# Altium schematic sheet DBBC7205S.SchDoc
size A2; SheetNumber: 1; SheetTotal: 1
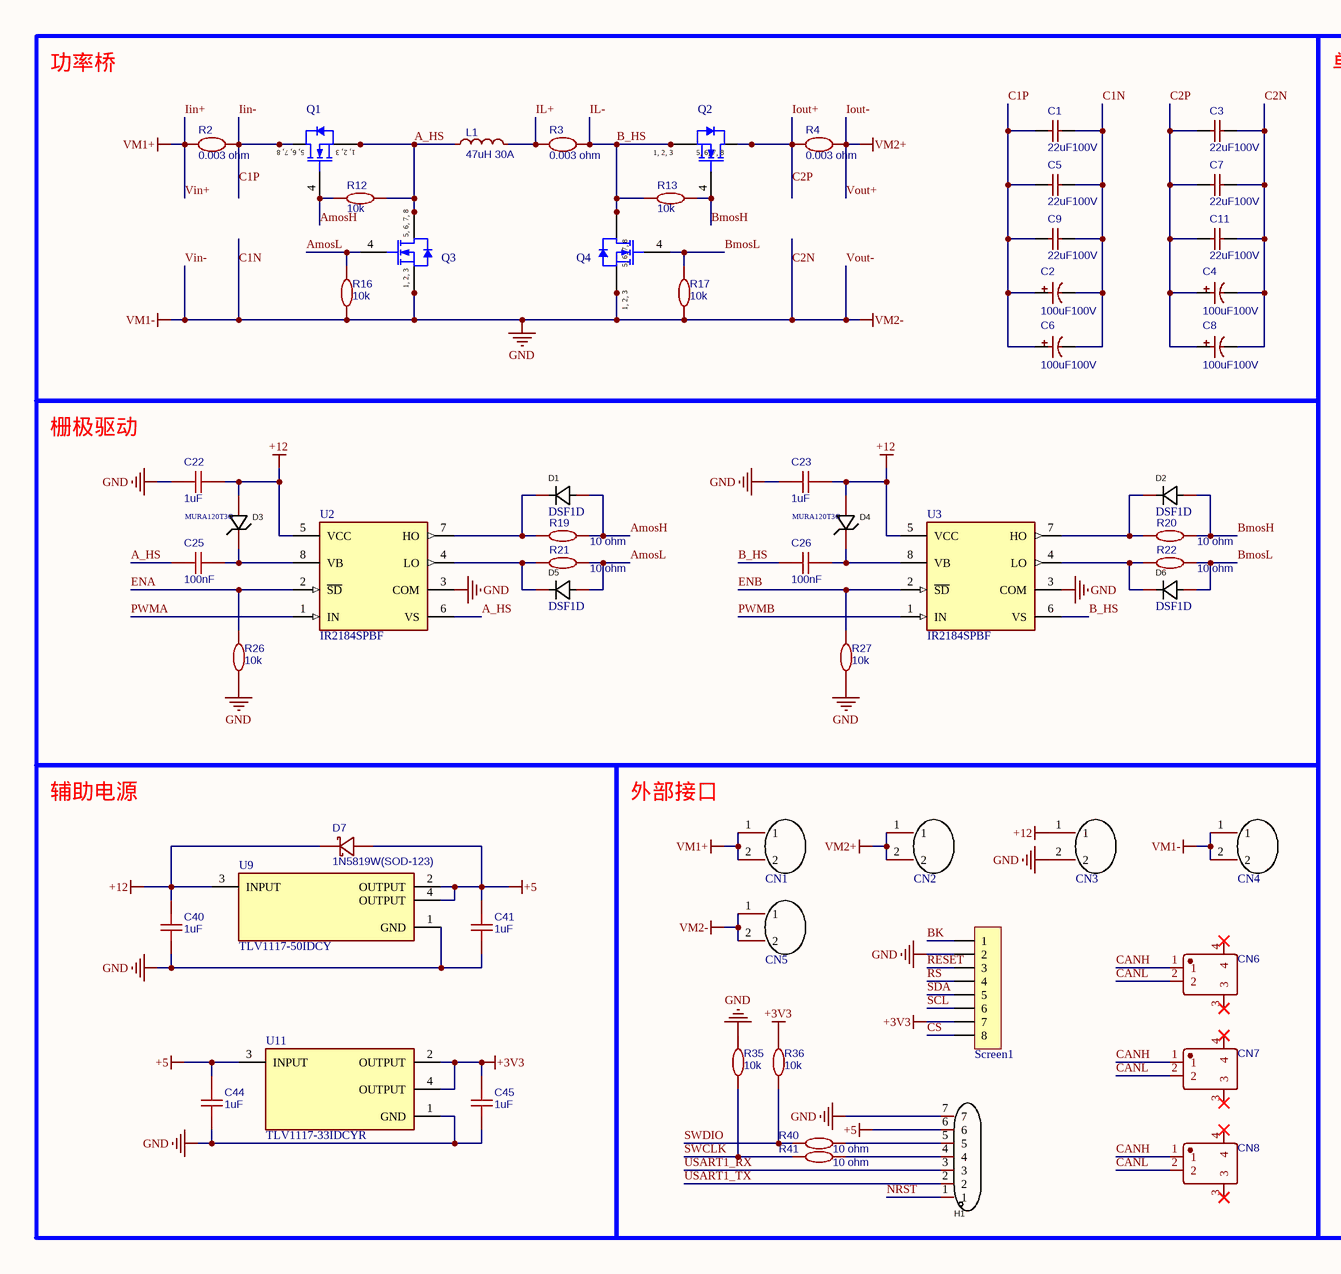
[diagram p0: DBBC7205S.SchDoc, left]
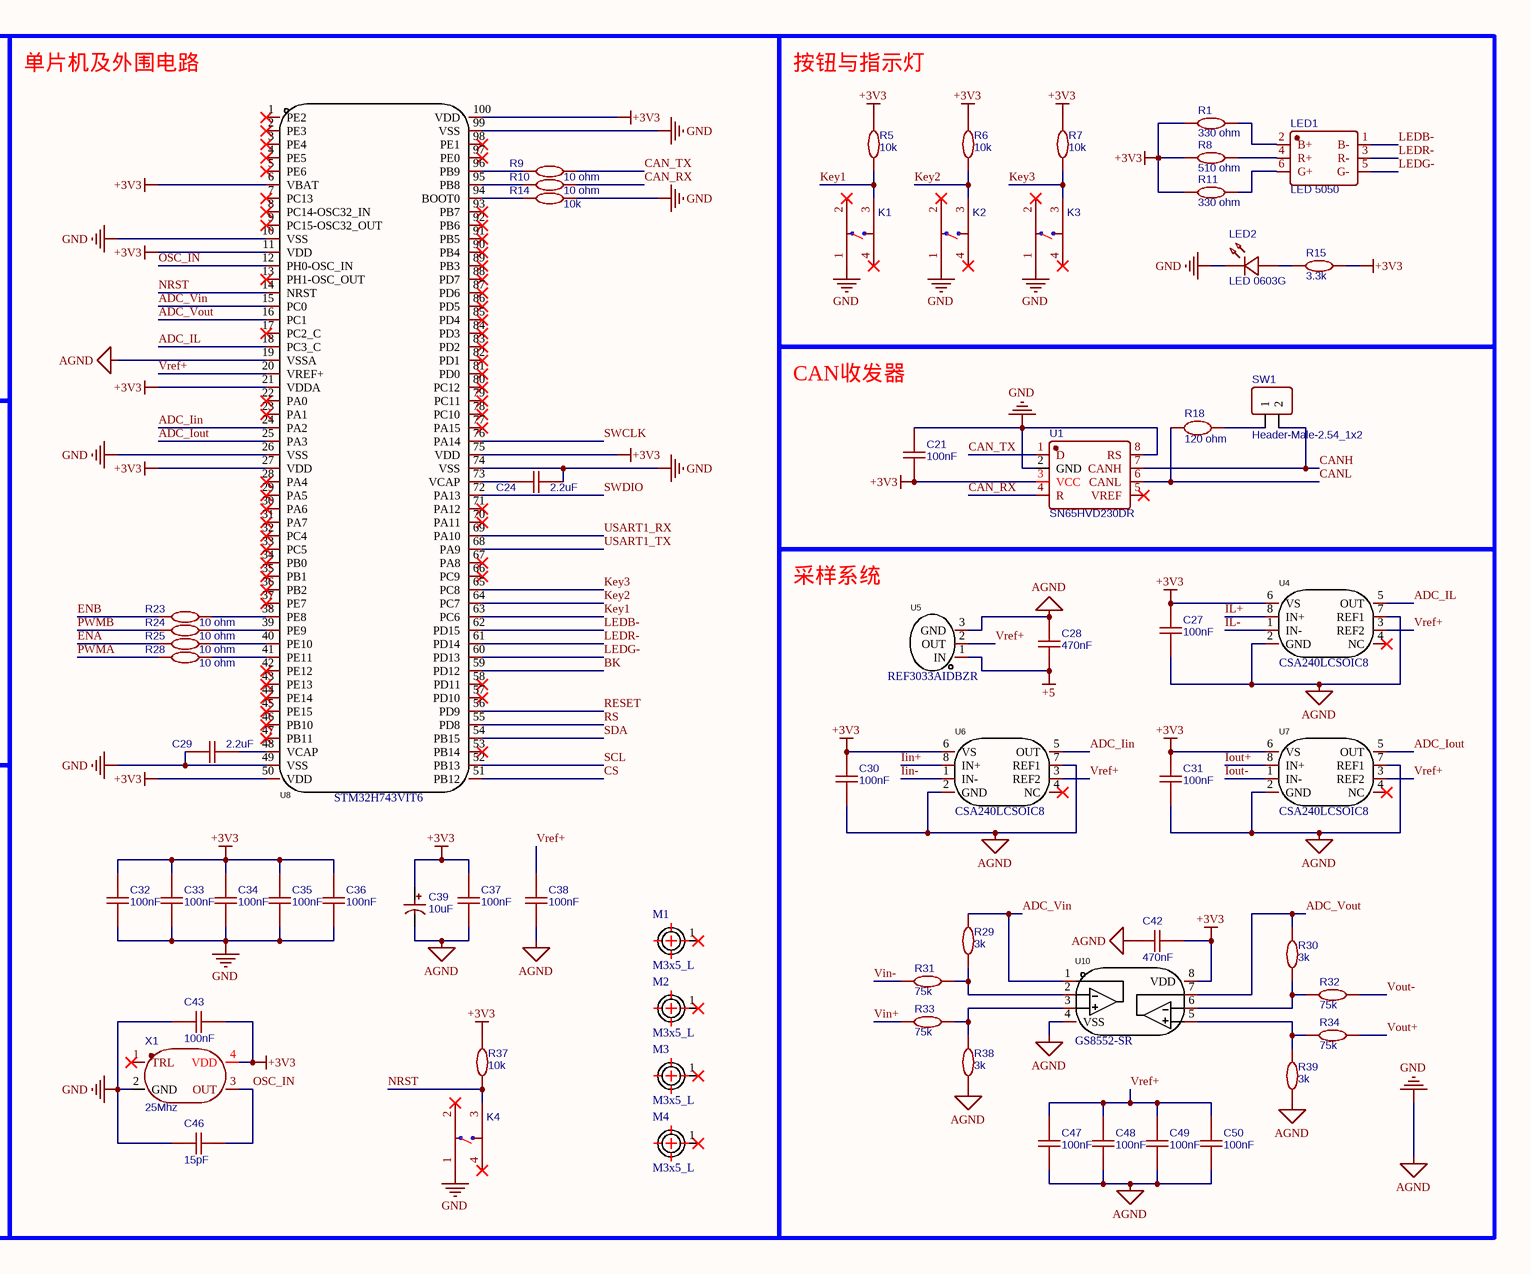
[diagram p1: DBBC7205S.SchDoc, right]

## Parts
C1  22uF100V  [C1206]
C2  100uF100V  [CAP 5.0*10*16]
C3  22uF100V  [C1206]
C4  100uF100V  [CAP 5.0*10*16]
C5  22uF100V  [C1206]
C6  100uF100V  [CAP 5.0*10*16]
C7  22uF100V  [C1206]
C8  100uF100V  [CAP 5.0*10*16]
C9  22uF100V  [C1206]
C11  22uF100V  [C1206]
C21  100nF  [C0603]
C22  1uF  [C0603]
C23  1uF  [C0603]
C24  2.2uF  [C0603]
C25  100nF  [C0603]
C26  100nF  [C0603]
C27  100nF  [C0603]
C28  470nF  [C0603]
C29  2.2uF  [C0603]
C30  100nF  [C0603]
C31  100nF  [C0603]
C32  100nF  [C0603]
C33  100nF  [C0603]
C34  100nF  [C0603]
C35  100nF  [C0603]
C36  100nF  [C0603]
C37  100nF  [C0603]
C38  100nF  [C0603]
C39  10uF  [CD A(3216)]
C40  1uF  [C0603]
C41  1uF  [C0603]
C42  470nF  [C0603]
C43  100nF  [C0603]
C44  1uF  [C0603]
C45  1uF  [C0603]
C46  15pF  [C0603]
C47  100nF  [C0603]
C48  100nF  [C0603]
C49  100nF  [C0603]
C50  100nF  [C0603]
CN1  1729128  [CONN-TH_2P-P5.08]  (value not drawn)
CN2  1729128  [CONN-TH_2P-P5.08]  (value not drawn)
CN3  1729128  [CONN-TH_2P-P5.08]  (value not drawn)
CN4  1729128  [CONN-TH_2P-P5.08]  (value not drawn)
CN5  1729128  [CONN-TH_2P-P5.08]  (value not drawn)
CN6  A1257WR-S-2P  [CONN-SMD_A1257WR-S-2P]  (value not drawn)
CN7  A1257WR-S-2P  [CONN-SMD_A1257WR-S-2P]  (value not drawn)
CN8  A1257WR-S-2P  [CONN-SMD_A1257WR-S-2P]  (value not drawn)
D1  DSF1D  [SOD-123_L2.8-W1.8-LS3.7-RD]
D2  DSF1D  [SOD-123_L2.8-W1.8-LS3.7-RD]
D3  MURA120T3G  [SMA]
D4  MURA120T3G  [SMA]
D5  DSF1D  [SOD-123_L2.8-W1.8-LS3.7-RD]
D6  DSF1D  [SOD-123_L2.8-W1.8-LS3.7-RD]
D7  1N5819W(SOD-123)  [SOD-123]
H1  7P卧贴排母  [HDR-SMD_7P-P2.54-H-F-L11.5]  (value not drawn)
K1  TSW SMD-6*6*5  [TSW SMD-6*6*5]  (value not drawn)
K2  TSW SMD-6*6*5  [TSW SMD-6*6*5]  (value not drawn)
K3  TSW SMD-6*6*5  [TSW SMD-6*6*5]  (value not drawn)
K4  TSW SMD-6*6*5  [TSW SMD-6*6*5]  (value not drawn)
L1  47uH 30A  [106-125卧式]
LED1  LED 5050  [LED 5050]
LED2  LED 0603G  [LED 0603G]
M1  M3x5_L  [M3x5_L]
M2  M3x5_L  [M3x5_L]
M3  M3x5_L  [M3x5_L]
M4  M3x5_L  [M3x5_L]
Q1  BSC070N10NS3 G  [INF-PG-TDSON-8-1_V]  (value not drawn)
Q2  BSC070N10NS3 G  [INF-PG-TDSON-8-1_V]  (value not drawn)
Q3  BSC070N10NS3 G  [INF-PG-TDSON-8-1_V]  (value not drawn)
Q4  BSC070N10NS3 G  [INF-PG-TDSON-8-1_V]  (value not drawn)
R1  330 ohm  [R0603]
R2  0.003 ohm  [R2512]
R3  0.003 ohm  [R2512]
R4  0.003 ohm  [R2512]
R5  10k  [R0603]
R6  10k  [R0603]
R7  10k  [R0603]
R8  510 ohm  [R0603]
R9  10 ohm  [R0603]
R10  10 ohm  [R0603]
R11  330 ohm  [R0603]
R12  10k  [R0603]
R13  10k  [R0603]
R14  10k  [R0603]
R15  3.3k  [R0603]
R16  10k  [R0603]
R17  10k  [R0603]
R18  120 ohm  [R0805]
R19  10 ohm  [R0603]
R20  10 ohm  [R0603]
R21  10 ohm  [R0603]
R22  10 ohm  [R0603]
R23  10 ohm  [R0603]
R24  10 ohm  [R0603]
R25  10 ohm  [R0603]
R26  10k  [R0603]
R27  10k  [R0603]
R28  10 ohm  [R0603]
R29  3k  [R0603]
R30  3k  [R0603]
R31  75k  [R0603]
R32  75k  [R0603]
R33  75k  [R0603]
R34  75k  [R0603]
R35  10k  [R0603]
R36  10k  [R0603]
R37  10k  [R0603]
R38  3k  [R0603]
R39  3k  [R0603]
R40  10 ohm  [R0603]
R41  10 ohm  [R0603]
Screen1  FPC0.5-8P  [FPC0.5 2H-S-W-8P]  (value not drawn)
SW1  Header-Male-2.54_1x2  [HDR2.54-LI-2P]
U1  SN65HVD230DR  [SOP-8]
U2  IR2184SPBF  [FP-PG-DSO-8-MFG]
U3  IR2184SPBF  [FP-PG-DSO-8-MFG]
U4  CSA240LCSOIC8  [SOIC-8_L4.9-W3.9-P1.27-LS6.0-BL]
U5  REF3033AIDBZR  [SOT-23-3_L3.0-W1.7-P0.95-LS2.9-BR]
U6  CSA240LCSOIC8  [SOIC-8_L4.9-W3.9-P1.27-LS6.0-BL]
U7  CSA240LCSOIC8  [SOIC-8_L4.9-W3.9-P1.27-LS6.0-BL]
U8  STM32H743VIT6  [LQFP-100_L14.0-W14.0-P0.50-LS16.0-BL]
U9  TLV1117-50IDCY  [FP-DCY0004A-MFG]
U10  GS8552-SR  [SOIC-8_L4.9-W3.9-P1.27-LS6.0-BL]
U11  TLV1117-33IDCYR  [FP-DCY0004A-MFG]
X1  25Mhz  [OSC 3225-4P]

## Blocks framed on the sheet
功率桥: C1-C9 C11 L1 Q1-Q4 R2-R4 R12 R13 R16 R17
单片机及外围电路: C24 C29 C32-C39 C43 C46 K4 M1-M4 R9 R10 R14 R23-R25 R28 R37 U8 X1
按钮与指示灯: K1-K3 LED1 LED2 R1 R5-R8 R11 R15
CAN收发器: C21 R18 SW1 U1
栅极驱动: C22 C23 C25 C26 D1-D6 R19-R22 R26 R27 U2 U3
采样系统: C27 C28 C30 C31 C42 C47-C50 R29-R34 R38 R39 U4-U7 U10
辅助电源: C40 C41 C44 C45 D7 U9 U11
外部接口: CN1-CN8 H1 R35 R36 R40 R41 Screen1

## Nets
+3V3: C21.1 C27.2 C30.2 C31.2 C32.2 C33.2 C34.2 C35.2 C36.2 C37.1 C39.1 C42.2 C43.2 C45.2 R1.2 R5.2 R6.2 R7.2 R8.2 R11.2 R15.1 R36.2 R37.2 Screen1.7 U1.3(VCC) U4.6(VS) U6.6(VS) U7.6(VS) U8.6(VBAT) U8.11(VDD) U8.21(VDDA) U8.27(VDD) U8.50(VDD) U8.75(VDD) U8.100(VDD) U10.8(VDD) U11.2(OUTPUT) U11.4(OUTPUT) X1.4(VDD)
+5: C28.1 C41.2 C44.2 D7.1(A) H1.6 U5.1(IN) U9.2(OUTPUT) U9.4(OUTPUT) U11.3(INPUT)
+12: C22.2 C23.2 C40.2 CN3.1 D3.1(A) D4.1(A) D7.2(K) U2.5(VCC) U3.5(VCC) U9.3(INPUT)
C1N: C1.2 C2.2 C3.2 C4.2 C5.2 C6.2 C7.2 C8.2 C9.2 C11.2 C21.2 C22.1 C23.1 C24.1 C27.1 C28.2 C29.2 C30.1 C31.1 C32.1 C33.1 C34.1 C35.1 C36.1 C37.2 C38.1 C39.2 C40.1 C41.1 C42.1 C43.1 C44.1 C45.1 C46.2 C47.2 C48.1 C49.1 C50.2 CN3.2 CN4.1 CN4.2 CN5.1 CN5.2 H1.7 K1.1 K2.1 K3.1 K4.1 LED2.2(K) Q3.1(SOURCE) Q3.2(SOURCE) Q3.3(SOURCE) Q4.1(SOURCE) Q4.2(SOURCE) Q4.3(SOURCE) R14.1 R16.1 R17.1 R26.1 R27.1 R31.1 R32.2 R35.2 R38.1 R39.1 Screen1.2 U1.2(GND) U1.8(RS) U2.3(COM) U3.3(COM) U4.2(GND) U4.7(REF1) U5.3(GND) U6.2(GND) U6.7(REF1) U7.2(GND) U7.7(REF1) U8.10(VSS) U8.19(VSSA) U8.26(VSS) U8.49(VSS) U8.74(VSS) U8.99(VSS) U9.1(GND) U10.4(VSS) U11.1(GND) X1.2(GND)  [also labelled AGND, C2N, GND, Vin-, VM1-, VM2-, Vout-]
Iin+: CN1.1 CN1.2 R2.1 R33.1 U6.8(IN+)  [also labelled Vin+, VM1+]
Iout-: CN2.1 CN2.2 R4.2 R34.2 U7.1(IN-)  [also labelled VM2+, Vout+]
A_HS: C25.2 L1.1 Q1.1(SOURCE) Q1.2(SOURCE) Q1.3(SOURCE) Q3.5(DRAIN) Q3.6(DRAIN) Q3.7(DRAIN) Q3.8(DRAIN) R12.1 U2.6(VS)
ADC_Iin: U6.5(OUT) U8.24(PA2)
ADC_IL: U4.5(OUT) U8.18(PC3_C)
ADC_Iout: U7.5(OUT) U8.25(PA3)
ADC_Vin: R29.2 U8.15(PC0) U10.1(OUTA)
ADC_Vout: R30.2 U8.16(PC1) U10.7(OUTB)
AmosH: D1.2(A) Q1.4(GATE) R12.2 R19.2
AmosL: D5.2(A) Q3.4(GATE) R16.2 R21.2
B_HS: C26.2 Q2.1(SOURCE) Q2.2(SOURCE) Q2.3(SOURCE) Q4.5(DRAIN) Q4.6(DRAIN) Q4.7(DRAIN) Q4.8(DRAIN) R3.2 R13.2 U3.6(VS) U4.1(IN-)  [also labelled IL-]
BK: Screen1.1 U8.59(PD12)
BmosH: D2.2(A) Q2.4(GATE) R13.1 R20.2
BmosL: D6.2(A) Q4.4(GATE) R17.2 R22.2
C1P: C1.1 C2.1 C5.1 C6.1 C9.1 Q1.5(DRAIN) Q1.6(DRAIN) Q1.7(DRAIN) Q1.8(DRAIN) R2.2 U6.1(IN-)  [also labelled Iin-]
C2P: C3.1 C4.1 C7.1 C8.1 C11.1 Q2.5(DRAIN) Q2.6(DRAIN) Q2.7(DRAIN) Q2.8(DRAIN) R4.1 U7.8(IN+)  [also labelled Iout+]
CAN_RX: R10.1 U1.4(R)
CAN_TX: R9.1 U1.1(D)
CANH: CN6.1 CN7.1 CN8.1 SW1.2 U1.7(CANH)
CANL: CN6.2 CN7.2 CN8.2 R18.1 U1.6(CANL)
CS: Screen1.8 U8.51(PB12)
ENA: R25.2 R26.2 U2.2(~{SD})
ENB: R23.2 R27.2 U3.2(~{SD})
IL+: L1.2 R3.1 U4.8(IN+)
Key1: K1.3 R5.1 U8.63(PC6)
Key2: K2.3 R6.1 U8.64(PC7)
Key3: K3.3 R7.1 U8.65(PC8)
LEDB-: LED1.1(B-) U8.62(PD15)
LEDG-: LED1.5(G-) U8.60(PD13)
LEDR-: LED1.3(R-) U8.61(PD14)
NRST: H1.1 K4.3 R37.1 U8.14(NRST)
OSC_IN: C46.1 U8.12(PH0-OSC_IN) X1.3(OUT)
PWMA: R28.2 U2.1(IN)
PWMB: R24.2 U3.1(IN)
RESET: Screen1.3 U8.56(PD9)
RS: Screen1.4 U8.55(PD8)
SCL: Screen1.6 U8.52(PB13)
SDA: Screen1.5 U8.54(PB15)
SWCLK: R35.1 R41.2 U8.76(PA14)
SWDIO: R36.1 R40.2 U8.72(PA13)
USART1_RX: H1.3 U8.69(PA10)
USART1_TX: H1.2 U8.68(PA9)
Vref+: C38.2 C47.1 C48.2 C49.2 C50.1 U4.3(REF2) U5.2(OUT) U6.3(REF2) U7.3(REF2) U8.20(VREF+)
NetC24_2: C24.2 U8.73(VCAP)
NetC25_1: C25.1 D3.2(C) U2.8(VB)
NetC26_1: C26.1 D4.2(C) U3.8(VB)
NetC29_1: C29.1 U8.48(VCAP)
NetD1_1: D1.1(K) R19.1 U2.7(HO)
NetD2_1: D2.1(K) R20.1 U3.7(HO)
NetD5_1: D5.1(K) R21.1 U2.4(LO)
NetD6_1: D6.1(K) R22.1 U3.4(LO)
NetH1_4: H1.4 R41.1
NetH1_5: H1.5 R40.1
NetLED1_2: LED1.2(B+) R1.1
NetLED1_4: LED1.4(R+) R8.1
NetLED1_6: LED1.6(G+) R11.1
NetLED2_1: LED2.1(A) R15.2
NetR9_2: R9.2 U8.96(PB9)
NetR10_2: R10.2 U8.95(PB8)
NetR14_2: R14.2 U8.94(BOOT0)
NetR18_2: R18.2 SW1.1
NetR23_1: R23.1 U8.38(PE8)
NetR24_1: R24.1 U8.39(PE9)
NetR25_1: R25.1 U8.40(PE10)
NetR28_1: R28.1 U8.41(PE11)
NetR29_1: R29.1 R31.2 U10.2(INA-)
NetR30_1: R30.1 R32.1 U10.6(INB-)
NetR33_2: R33.2 R38.2 U10.3(INA+)
NetR34_1: R34.1 R39.2 U10.5(INB+)

Not connected (* = marked no-connect by the designer): CN6 3* 4*; CN7 3* 4*; CN8 3* 4*; K1 2* 4*; K2 2* 4*; K3 2* 4*; K4 2* 4*; M1 1*; M2 1*; M3 1*; M4 1*; U1 5(VREF)*; U4 4(NC)*; U6 4(NC)*; U7 4(NC)*; U8 1(PE2)* 2(PE3)* 3(PE4)* 4(PE5)* 5(PE6)* 7(PC13)* 8(PC14-OSC32_IN)* 9(PC15-OSC32_OUT)* 13(PH1-OSC_OUT)* 17(PC2_C)* 22(PA0)* 23(PA1)* 28(PA4)* 29(PA5)* 30(PA6)* 31(PA7)* 32(PC4)* 33(PC5)* 34(PB0)* 35(PB1)* 36(PB2)* 37(PE7)* 42(PE12)* 43(PE13)* 44(PE14)* 45(PE15)* 46(PB10)* 47(PB11)* 53(PB14)* 57(PD10)* 58(PD11)* 66(PC9)* 67(PA8)* 70(PA11)* 71(PA12)* 77(PA15)* 78(PC10)* 79(PC11)* 80(PC12)* 81(PD0)* 82(PD1)* 83(PD2)* 84(PD3)* 85(PD4)* 86(PD5)* 87(PD6)* 88(PD7)* 89(PB3)* 90(PB4)* 91(PB5)* 92(PB6)* 93(PB7)* 97(PE0)* 98(PE1)*; X1 1(TRL)*

## Notes on the sheet
- (in symbol BSC070N10NS3G) 5, 6, 7, 8; 1, 2, 3

## Library data of the parts
C1 C3 C5 C7 C9 C11 = C1206: BOM_Manufacturer: FH; BOM_Manufacturer Part: 1206B102K202NT; nameAlias: Capacitance; BOM_Supplier: LCSC; BOM_Supplier Part: C9196; BOM_JLCPCB Part Class: Basic Part; spicePre: C; spiceSymbolName: 1206B102K202NT
C2 C4 C6 C8 = CAP 5.0*10*16: 脚距5mm直径10mm高度16mm; BOM_Manufacturer: ValuePro; BOM_Manufacturer Part: 50V 100uF 8X12; nameAlias: Capacitance; BOM_Supplier: LCSC; BOM_Supplier Part: C2749; BOM_JLCPCB Part Class: Extended Part; spicePre: C; spiceSymbolName: 50V 100uF 8X12
C21-C38 C40-C50 = C0603: BOM_Manufacturer: YAGEO; BOM_Manufacturer Part: CC0603KRX7R9BB104; nameAlias: Capacitance; BOM_Supplier: LCSC; BOM_Supplier Part: C14663; BOM_JLCPCB Part Class: Basic Part; spicePre: C; spiceSymbolName: CC0603KRX7R9BB104
C39 = A型钽电容: 长3.2mm，宽1.6mm，厚1.6mm; BOM_Manufacturer: ValuePro; BOM_Manufacturer Part: 50V 100uF 8X12; nameAlias: Capacitance; BOM_Supplier: LCSC; BOM_Supplier Part: C2749; BOM_JLCPCB Part Class: Extended Part; spicePre: C; spiceSymbolName: 50V 100uF 8X12
CN1-CN5 = MKDSN5.08-2P: 间距:5.08mm;排数:1;每排PIN数:2;安装方式:直针;额定电流:13.5A;额定电压:400V;工作温度范围:-;颜色:绿色;; Manufacturer: Phoenix Contact(菲尼克斯); Symbol: MKDSN1.5/2-5.08; Add into BOM: yes; Pitch: 5.08mm; Number of PINs Per Row: 2; Current Rating (Max): 13.5A; Voltage Rating (Max): 400V; Device: 1729128; LCSC Part Name: 5.08mm 排数:1 每排P数:2 直针; Supplier Part: C91153; Manufacturer Part: 1729128; Supplier Footprint: 插件,P=5.08mm; JLCPCB Part Class: Extended Part; Datasheet: https://atta.szlcsc.com/upload/public/pdf/source/20161226/1482720163948.pdf; Supplier: LCSC; Convert to PCB: yes; Number of Rows: 1; Mounting Style: 直针; Operating Temperature Range: -; Color: 绿色
CN6-CN8 = A1257WR-S-2P: BOM_Manufacturer: Changjiang Connectors; BOM_Manufacturer Part: A1257WV-S-2P; Contributor: LCSC; BOM_Supplier: LCSC; BOM_Supplier Part: C225118; BOM_JLCPCB Part Class: Extended Part; spicePre: C; spiceSymbolName: A1257WV-S-2P
D1 D2 D5 D6 = DSF1D: 小封装快恢复二极管; Manufacturer: FUXINSEMI(富芯森美); Symbol: DSF1D_C915614; Add into BOM: yes; Diode Configuration: 独立式; Forward Voltage (Vf@If): 950mV@1A; Reverse Voltage (Vr): 200V; Average Rectified Current (Io): 1A; Reverse Leakage Current: 5mA; Reverse Recovery Time (trr): 35ns; Device: DSF1D_C915614; Supplier: LCSC; Supplier Part: C915614; Manufacturer Part: DSF1D; JLCPCB Part Class: Extended Part; LCSC Part Name: 电压:200V 电流:1A; Supplier Footprint: SOD-123; Datasheet: https://atta.szlcsc.com/upload/public/pdf/source/20220617/70FC00B35BDEA29A28FAEA4D4AB0042F.pdf; Convert to PCB: yes; Operating Temperature: -55℃~+150℃@(Tj)
D3 D4 = MURA120T3G: 25ns 0.875V压降 1A快恢复二极管; Manufacturer: MDD; Name: ES1J; Symbol: ES1JG_C412438; Device: ES1J_C412438; Add into BOM: yes; Diode Configuration: 独立式; Reverse Voltage (Vr): 600V; Average Rectified Current (Io): 1A; Forward Voltage (Vf@If): 1.7V@1A; Reverse Leakage Current: 5uA@600V; Reverse Recovery Time (trr): 35ns; LCSC Part Name: 600V 1A 35ns; Supplier Part: C412438; Manufacturer Part: ES1J; Supplier Footprint: SMA; JLCPCB Part Class: Extended Part; Datasheet: https://atta.szlcsc.com/upload/public/pdf/source/20200710/C412438_D778E045B8BDD674EB487A7C2F57C90E.pdf; Supplier: LCSC; Convert to PCB: yes; Operating Temperature: -55℃~+150℃@(Tj)
D7 = 1N5819W(SOD-123): BOM_Manufacturer: Doeshare(德芯); BOM_Manufacturer Part: SS34; Contributor: LCSC; BOM_Supplier: LCSC; BOM_Supplier Part: C2931787; BOM_JLCPCB Part Class: Extended Part; spicePre: D; spiceSymbolName: SS34_C2931787
H1 = 7P卧贴排母: Manufacturer: XKB Connectivity(中国星坤); Name: X6511FRS-07-C85D30; Add into BOM: yes; Holes Structure: 1x7P; Pitch: 2.54mm; Number of Holes: 7P; Symbol: X6511FRS-07-C85D30; Device: X6511FRS-07-C85D30; LCSC Part Name: 间距:2.54mm 1x7P 卧贴; Supplier Part: C5142240; Manufacturer Part: X6511FRS-07-C85D30; Supplier Footprint: SMD,P=2.54mm; JLCPCB Part Class: Extended Part; Datasheet: https://atta.szlcsc.com/upload/public/pdf/source/20220822/AB9A82E80C220285963E5EFA3BFD32FF.pdf; Supplier: LCSC; Convert to PCB: yes; Mounting Type: 卧贴; Number of Rows: 单排; Insulation Height: 8.5mm
K1-K4 = TSW SMD-6*6*5: BOM_Manufacturer: GANGYUAN(港源); BOM_Manufacturer Part: KAN0661-1001B; Contributor: LCSC; BOM_Supplier: LCSC; BOM_Supplier Part: C231715; BOM_JLCPCB Part Class: Extended Part; spicePre: S; spiceSymbolName: KAN0661-1001B
L1 = 106-125铁硅铝磁环电感: BOM_Manufacturer: FH(风华); BOM_Manufacturer Part: HA42-4R7MT; nameAlias: Inductance; Contributor: LCSC; BOM_Supplier: LCSC; BOM_Supplier Part: C2936653; BOM_JLCPCB Part Class: Extended Part; spicePre: L; spiceSymbolName: HA42-4R7MT
LED1 = LED 5050: 5050RGB-LED; BOM_Manufacturer: EVERLIGHT(台湾亿光); BOM_Manufacturer Part: 11-21/BHC-AQ2S2/2T; Contributor: lcsc; BOM_Supplier: LCSC; BOM_Supplier Part: C3014404; spicePre: L; spiceSymbolName: 11-21/BHC-AQ2S2/2T
LED2 = LED 0603G: 绿色0603LED; BOM_Manufacturer: EVERLIGHT(台湾亿光); BOM_Manufacturer Part: 11-21/BHC-AQ2S2/2T; Contributor: lcsc; BOM_Supplier: LCSC; BOM_Supplier Part: C3014404; spicePre: L; spiceSymbolName: 11-21/BHC-AQ2S2/2T
M1-M4 = M3x5_L: M3铜柱，长：5mm
Q1-Q4 = BSC070N10NS3G: N-Channel OptiMOS 3 Power-Transistor, 100 V VDS, 90 A ID, -55 to 150 degC, PG-TDSON-8-1, Reel, Green; Manufacturer: Infineon; QG: 42Â nC; VGS(th) (min): 2Â V; RDS (on) (max): 7Â mOhm; ID (max): 90Â A; Polarity: N; RthJC (max): 1.1Â K/W; RthJA (max): 50Â K/W; VDS (max): 100Â V; Ptot (max): 114Â W; VGS(th) (max): 3.5Â V; IDpuls (max): 360Â A; Green: TRUE; ComponentLink2Description: Datasheet; DatasheetVersion: Rev. 2.0; Mounting Technology: Surface Mount; ComponentLink1Description: Manufacturer URL; ComponentLink3Description: Package Specification; ComponentLink1URL: http://www.infineon.com/; PackageDescription: 8-Pin Plastic (Green) Thin Dual Small Outline Non-Leaded Package, 5.15 x 5.9 mm Body, 1.27 mm Pitch; Packing: Reel; ComponentLink3URL: http://www.infineon.com/cms/packages/SMD_-_Surface_Mounted_Devices/P-PG-TDSON/P-PG-TDSON-08-01x_2x_3.html?__locale=en; PackageReference: PG-TDSON-8-1; PartNumber: BSC070N10NS3 G; Halogen-free: TRUE; Rth: 1.1Â K/W; ComponentLink2URL: http://www.infineon.com/dgdl/BSC070N10NS3+Rev2+1.pdf?folderId=db3a304313b8b5a60113cee8763b02d7&fileId=db3a304327b89750012824712c6c6f2f; Manufacturer Part Number: BSC070N10NS3G
R1 R5-R17 R19-R41 = R0603: BOM_Manufacturer: YAGEO; BOM_Manufacturer Part: SR0603JR-071RL; nameAlias: Resistance (Ohms); Contributor: LCSC; Resistance: 1Ω; BOM_Supplier: LCSC; BOM_Supplier Part: C326890; BOM_JLCPCB Part Class: Extended Part; spicePre: R; spiceSymbolName: SR0603JR-071RL
R2-R4 = R2512: BOM_Manufacturer: YAGEO; BOM_Manufacturer Part: SR2512FK-0751RL; nameAlias: Resistance (Ohms); Contributor: LCSC; Resistance: 51Ω; BOM_Supplier: LCSC; BOM_Supplier Part: C375694; BOM_JLCPCB Part Class: Extended Part; spicePre: R; spiceSymbolName: SR2512FK-0751RL
R18 = R0805: BOM_Manufacturer: YAGEO; BOM_Manufacturer Part: SR0805FR-0710RL; Contributor: LCSC; Resistance: 10Ω; BOM_Supplier: LCSC; BOM_Supplier Part: C723409; BOM_JLCPCB Part Class: Extended Part; spicePre: R; spiceSymbolName: SR0805FR-0710RL
Screen1 = FPC-8P-0.5: FPC连接器; 版权归属: 黎明电子style; BOM名称: FPC连接器; 学习资源: https://lmdzstyle.taobao.com/
SW1 = Header-Male-2.54_1x2: BOM_Manufacturer: BOOMELE; BOM_Manufacturer Part: Header2.54mm 1*3P; BOM_Supplier: LCSC; BOM_Supplier Part: C49257; BOM_JLCPCB Part Class: Extended Part; spicePre: H; spiceSymbolName: Header-Male-2.54_1x3
U1 = SN65HVD230DR: 常用CAN收发器; BOM_Manufacturer: TI; BOM_Supplier: LCSC; BOM_Manufacturer Part: SN65HVD230DR; BOM_Supplier Part: C12084; BOM_JLCPCB Part Class: Basic Part; spicePre: U; spiceSymbolName: SN65HVD230DR
U2 U3 = CMP-32851-000025-1: IC GATE DRVR HALF-BRIDGE 8SOIC; Manufacturer: Infineon; Min Supply Voltage: 10V; Number Of Outputs: 1; Turn On Delay Time: 680ns; Max Supply Voltage: 20V; Number Of Drivers: 2; Max Junction Temp: +150°C; Nominal Supply Current: 60-1000uA; Turn Off Delay Time: 270ns; Standoff Height: 0.1mm; Max Power Dissipation: 0.625W; Rise Time: 40ns; Fall Time: 20ns; Temperature: to +150°C; Height: 1.75mm; Ambient Temperature Range High: +125°C; Manufacturer Part Number: IR2184SPBF; ComponentLink2URL: https://www.infineon.com/dgdl/ir2184.pdf?fileId=5546d462533600a4015355c955e616d4; ComponentLink2Description: Datasheet; RoHS: TRUE; Octopart: https://octopart.com/ir2184spbf-infineon-65872954; Ipc Land Pattern Name: SOIC127P600X155-8; Package: PG-DSO-8; Footprint Url: https://www.infineon.com/dgdl/Infineon-po-8leadsoic-P-v01_00-EN.pdf?fileId=5546d462580663ef0158068b4ad80177; Category: IC; Digikey Description: IC GATE DRVR HALF-BRIDGE 8SOIC; Automotive: No; Device Class L3: Gate Drivers; Device Class L2: Power Management ICs; Temperature Range High: +150°C; Lead Free: Yes; Ambient Temperature Range Low: -40°C; Device Class L1: Integrated Circuits (ICs)
U4 U6 U7 = CSA240LCSOIC8: 低噪声低温漂双向电流高端检测芯片; Manufacturer: analogysemi(类比半导体); Add into BOM: yes; Number of Channels: 1; Common Mode Voltage: 6V~80V; Gain: 20V/V; Supply Voltage: 2.7V~5.5V; Name: CSA240LCSOIC8; Symbol: CSA240LCSOIC8; Device: CSA240LCSOIC8; LCSC Part Name: 线性产品; Supplier Part: C5359411; Manufacturer Part: CSA240LCSOIC8; Supplier Footprint: SOIC-8; JLCPCB Part Class: Extended Part; Datasheet: https://atta.szlcsc.com/upload/public/pdf/source/20230221/4ACBE0500A397B3D4468D76F97F173B7.pdf; Supplier: LCSC; Convert to PCB: yes; Operating Temperature: -40℃~125℃
U5 = REF3033AIDBZR: 3.3V基准电压源; Manufacturer: TI(德州仪器); Add into BOM: yes; Reference Type: 串联; Output Type: 固定; Input Voltage: 3.35V~5.5V; Output Voltage: 3.3V; Output Current: 25mA; Tolerance: ±0.2%; Temperature Coefficient: 75ppm/℃; Supply Current: 50uA; Noise - 10Hz to 10kHz: 105uVrms; Name: REF3033AIDBZR; Symbol: REF3033AIDBZR; Device: REF3033AIDBZR; LCSC Part Name: REF3033AIDBZR; Supplier Part: C36658; Manufacturer Part: REF3033AIDBZR; Supplier Footprint: SOT-23; JLCPCB Part Class: Extended Part; Datasheet: https://www.ti.com/cn/lit/gpn/ref3020; Supplier: LCSC; Convert to PCB: yes; Operating Temperature: -40℃~+125℃@(Ta)
U8 = STM32H743VIT6: STM32H7; Manufacturer: ST(意法半导体); Symbol: STM32H743VIT6_C114409; Add into BOM: yes; CPU Maximum Speed: 480MHz; Operating Voltage Range: 1.71V~3.6V; Program Storage Size: 2MB; GPIO Ports Number: 82; ADC (Bit): 16bit; DAC (Bit): 12bit; Universal Serial Bus: 有; Name: STM32H743VIT6; Device: STM32H743VIT6_C114409; LCSC Part Name: 480MHz; Supplier Part: C114409; Manufacturer Part: STM32H743VIT6; Supplier Footprint: LQFP-100(14x14); JLCPCB Part Class: Extended Part; Datasheet: https://atta.szlcsc.com/upload/public/pdf/source/20200508/C529058_DA70143F266D6D825C3A912656F12A87.pdf; Supplier: LCSC; Convert to PCB: yes; Watchdog: 有; Infrared Data Association: 有; Low-Voltage Detect: 有; LCD Module: 有; Secure Digital Input and Output: 有; Direct Memory Access: 有; Internal Oscillator: 有; Operating Temperature Range: -40℃~+85℃
U9 = CMP-04917-000165-1: IC REG LINEAR 5V 800MA SOT223-4; Dropout Voltage: 1.2V; Input Bias Current: 5mA; Output Type: Fixed; Quiescent Current: 15mA; Number of Regulators: 1; Min Input Voltage: 6.4V; Polarity: Positive; Max Input Voltage: 15V; Reference Voltage: 5.2V; Case/Package: SOT-223; Series: -; Radiation Hardening: No; Width: 3.7mm; Lead Free: Lead Free; Min Operating Temperature: -40°C; Mount: Surface Mount; Packaging: Rail/Tube; Min Current Limit: 800mA; Max Output Current: 800mA; Height: 1.7mm; Output Current: 800mA; Number of Outputs: 1; REACH SVHC: No SVHC; Nominal Output Voltage: 5V; Length: 6.7mm; Max Operating Temperature: 125°C; Output Voltage: 5V; Number of Pins: 3; Package Quantity: 80; RoHS Compliant: Yes
U10 = GS8552-SR: 1.5MHZ, 轨到轨高精双通道运放; Manufacturer: Gainsil(聚洵); Add into BOM: yes; Number of Circuits: 双路; Supply Voltage: 1.8V~5.5V; Gain Bandwidth Product(GBP): 1.8MHz; Slew Rate(SR): 0.95V/us; Supply Current: 180uA; Name: GS8552-SR; Symbol: GS8552-SR; Device: GS8552-SR; LCSC Part Name: GS8552-SR; Supplier Part: C157716; Manufacturer Part: GS8552-SR; Supplier Footprint: SOIC-8; JLCPCB Part Class: Extended Part; Datasheet: https://atta.szlcsc.com/upload/public/pdf/source/20200615/C605420_EE0E567F8FF01D919583B114644E1CC3.pdf; Supplier: LCSC; Convert to PCB: yes; Operating Temperature: -40℃~+125℃
U11 = CMP-04917-000056-1: IC REG LIN 3.3V 800MA SOT223-4; Manufacturer: Texas Instruments; Nominal Supply Current: 5mA; Dropout Voltage: 1.2V; Max Supply Voltage: 15V; Min Supply Voltage: 4.7V; Output Type: Fixed; Number Of Outputs: 1; Output Current: 0.8A; Standoff Height: 0.02mm; Max Junction Temp: +125°C; Lead Free: Yes; RoHS: TRUE; Temperature: -40°C to +125°C; Device Class L1: Integrated Circuits (ICs); Output Voltage: 3.3V; Device Class L3: Voltage Regulators - Linear; Octopart: https://octopart.com/tlv1117-33idcyr-texas+instruments-669250; Device Class L2: Power Management ICs; Package: DCY0004A; Temperature Range High: +125°C; Category: IC; Height: 1.8mm; Automotive: No; Digikey Description: IC REG LIN 3.3V 800MA SOT223-4; Temperature Range Low: -40°C; ComponentLink2URL: http://www.ti.com/lit/ds/symlink/tlv1117.pdf; ComponentLink2Description: Datasheet; Manufacturer Part Number: TLV1117-33IDCYR; Mouser Description: LDO Voltage Regulators Fixed LDO Volt Reg
X1 = OSC-3225: BOM_Manufacturer: TAE(雅晶鑫); BOM_Manufacturer Part: TFOM8M4RHKCNT2T; Contributor: LCSC; BOM_Supplier: LCSC; BOM_Supplier Part: C454610; BOM_JLCPCB Part Class: Extended Part; spicePre: X; spiceSymbolName: TFOM8M4RHKCNT2T